# Altium schematic sheet PowerR3.SchDoc: Power
size A; Revision: 3; SheetNumber: 4; SheetTotal: 5; RevisionHistory: Updated from v3.2 Miniscope.org
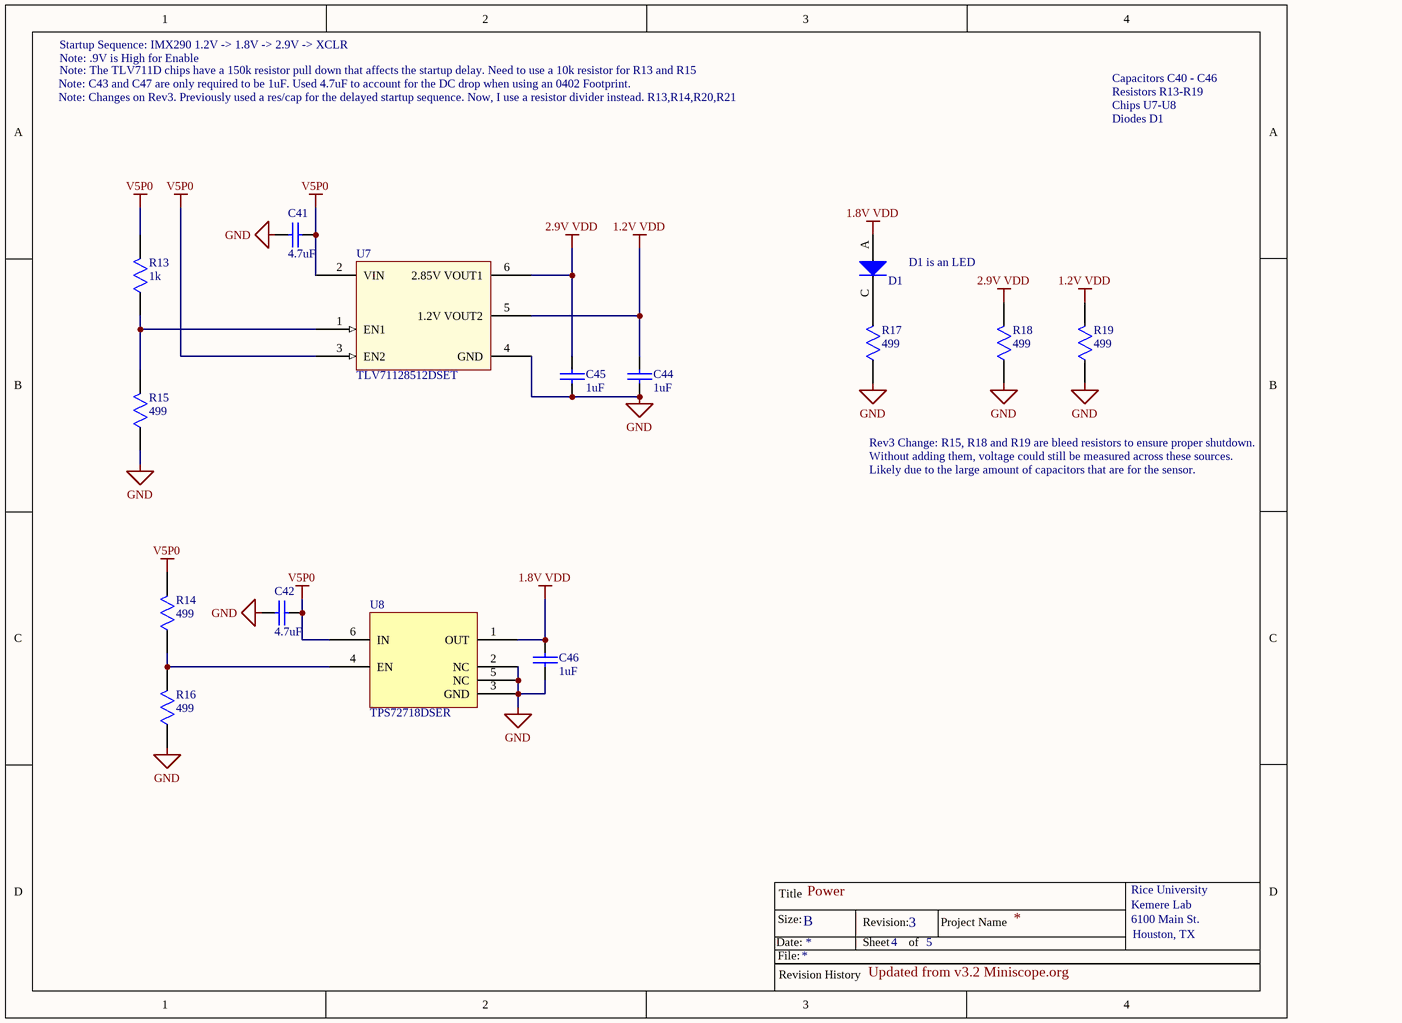
[diagram p0: PowerR3.SchDoc]

## Parts
C41  4.7uF  [SMD CAP 0402]
C42  4.7uF  [SMD CAP 0402]
C44  1uF  [SMD CAP 0402]
C45  1uF  [SMD CAP 0402]
C46  1uF  [SMD CAP 0402]
D1  LED 0603  [LED_0603]  (value not drawn)
R13  1k  [SMD RES 0402]
R14  499  [SMD RES 0402]
R15  499  [SMD RES 0402]
R16  499  [SMD RES 0402]
R17  499  [SMD RES 0402]
R18  499  [SMD RES 0402]
R19  499  [SMD RES 0402]
U7  TLV71128512DSET  [DSE]
U8  TPS72718DSER  [DSE]

## Nets
1.2V VDD: C44.0 R19.1 U7.5(1.2V_VOUT2)
1.8V VDD: C46.1 D1.A U8.1(OUT)
2.9V VDD: C45.0 R18.1 U7.6(2.85V_VOUT1)
GND: C41.1 C42.0 C44.1 C45.1 C46.0 R15.0 R16.0 R17.0 R18.0 R19.0 U7.4(GND) U8.2(NC) U8.3(GND) U8.5(NC)
V5P0: C41.0 C42.1 R13.1 R14.1 U7.2(VIN) U7.3(EN2) U8.6(IN)
NetD1_C: D1.C R17.1
NetR13_0: R13.0 R15.1 U7.1(EN1)
NetR14_0: R14.0 R16.1 U8.4(EN)

## Notes on the sheet
- Note: C43 and C47 are only required to be 1uF. Used 4.7uF to account for the DC drop when using an 0402 Footprint.
- Note: Changes on Rev3. Previously used a res/cap for the delayed startup sequence. Now, I use a resistor divider instead. R13,R14,R20,R21
- Note: .9V is High for Enable
- Note: The TLV711D chips have a 150k resistor pull down that affects the startup delay. Need to use a 10k resistor for R13 and R15
- Startup Sequence: IMX290 1.2V -> 1.8V -> 2.9V -> XCLR
- Capacitors C40 - C46
- Resistors R13-R19
- Chips U7-U8
- Diodes D1
- (near D1) D1 is an LED
- Rev3 Change: R15, R18 and R19 are bleed resistors to ensure proper shutdown.
- Without adding them, voltage could still be measured across these sources.
- Likely due to the large amount of capacitors that are for the sensor.
- Title
- Rice University
- Kemere Lab
- Date:
- Size:
- File:
- Revision History
- B
- Revision:
- Sheet
- of
- Project Name
- 6100 Main St.
- Houston, TX

## Library data of the parts
C41 C42 C44-C46 = Capacitor: Value: C?
D1 = LED 0603: LTST_C195TBJRKT
R13-R19 = Resistor: Value: ?
U7 = TLV71128512DSET: Dual 2.85V and 1.2V Linear Regulator
U8 = TPS72718DSER: Single 1.8V Linear Regulator